# EAGLE design drone (EAGLE 9.5.2)
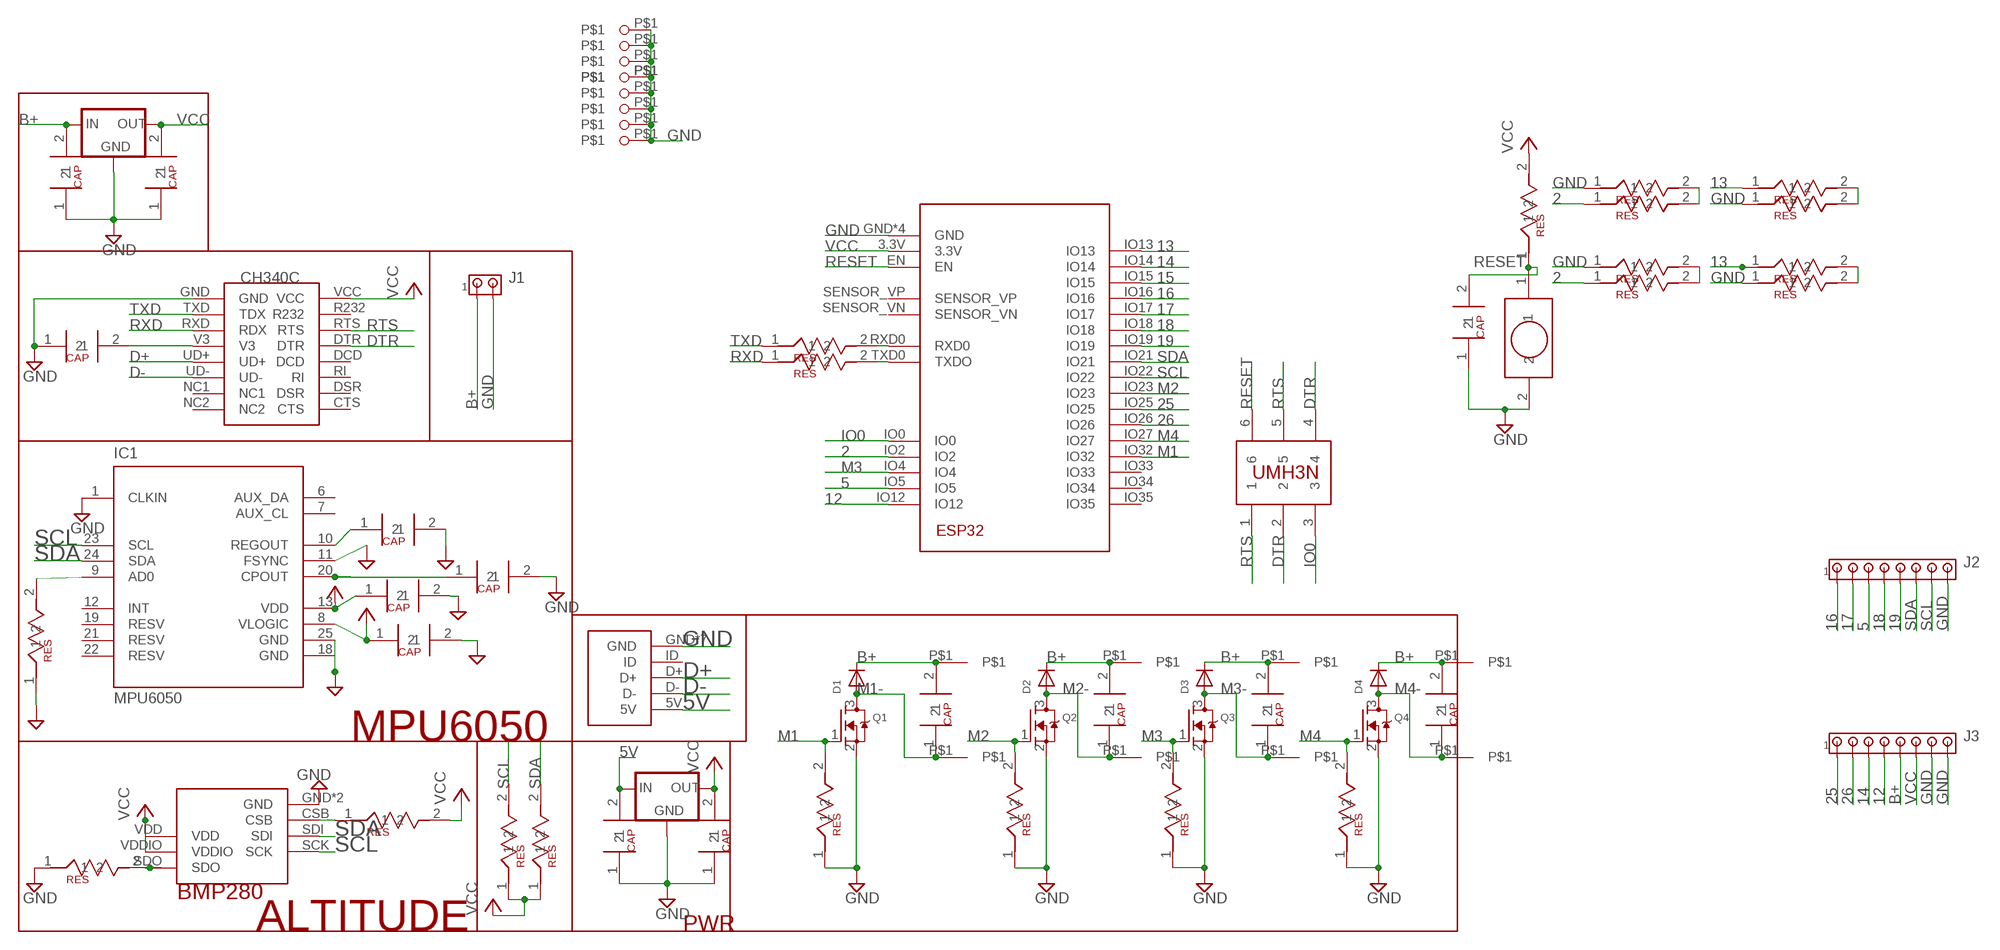
[diagram p0: schematic, sheet 1]

## Parts
D1  DIODESOD-323F  [SOD-323F]
D2  DIODESOD-323F  [SOD-323F]
D3  DIODESOD-323F  [SOD-323F]
D4  DIODESOD-323F  [SOD-323F]
IC1  MPU6050  [QFN50P400X400X95-25T265X275N]
IC2  SELF_VREG3.3MP  [SOT223]
IC3  SELF_VREG3.3MP  [SOT223]
J1  MTA02-100  [10X02MTA]
J2  MTA08-100  [10X08MTA]
J3  MTA08-100  [10X08MTA]
Q1  MOSFET-NREFLOW  [SOT23]
Q2  MOSFET-NREFLOW  [SOT23]
Q3  MOSFET-NREFLOW  [SOT23]
Q4  MOSFET-NREFLOW  [SOT23]
U1  ESP32  [MODULE_ESP-WROOM-32]
U$1  MICROUSB  [USB]
U$2  CH340C  [SOIC16]
U$3  BMP280  [BMP280]
U$4  SELF_RESISTOR_0603  [SELF_RESISTOR_0603]
U$5  SELF_RESISTOR_0603  [SELF_RESISTOR_0603]
U$6  SELF_CAP_0603  [SELF_CAP_0603]
U$7  SELF_RESISTOR_0603  [SELF_RESISTOR_0603]
U$8  SELF_CAP_0603  [SELF_CAP_0603]
U$9  SELF_CAP_0603  [SELF_CAP_0603]
U$10  SELF_CAP_0603  [SELF_CAP_0603]
U$11  SELF_RESISTOR_0603  [SELF_RESISTOR_0603]
U$12  SELF_RESISTOR_0603  [SELF_RESISTOR_0603]
U$13  SELF_CAP_0603SELF_CAP_0805  [SELF_CAP_0805]
U$14  SELF_CAP_0603SELF_CAP_0805  [SELF_CAP_0805]
U$15  SELF_CAP_0603  [SELF_CAP_0603]
U$16  SELF_RESISTOR_0603  [SELF_RESISTOR_0603]
U$17  SELF_RESISTOR_0603  [SELF_RESISTOR_0603]
U$18  SELF_CAP_0603SELF_CAP_0805  [SELF_CAP_0805]
U$19  SELF_CAP_0603SELF_CAP_0805  [SELF_CAP_0805]
U$20  SELF_RESISTOR_0603  [SELF_RESISTOR_0603]
U$21  SELF_RESISTOR_0603  [SELF_RESISTOR_0603]
U$22  SELF_RESISTOR_0603  [SELF_RESISTOR_0603]
U$23  SELF_RESISTOR_0603  [SELF_RESISTOR_0603]
U$24  SELF_CAP_0603  [SELF_CAP_0603]
U$25  SELF_CAP_0603  [SELF_CAP_0603]
U$26  SELF_CAP_0603  [SELF_CAP_0603]
U$27  SELF_CAP_0603  [SELF_CAP_0603]
U$28  UMH3N  [UMH3N]
U$29  SELF_PUSHBUTTON  [SELF_PUSHBUTTON]
U$30  SELF_RESISTOR_0603  [SELF_RESISTOR_0603]
U$31  SELF_CAP_0603  [SELF_CAP_0603]
U$32  SELF_RESISTOR_0603  [SELF_RESISTOR_0603]
U$33  SELF_RESISTOR_0603  [SELF_RESISTOR_0603]
U$34  SELF_RESISTOR_0603  [SELF_RESISTOR_0603]
U$35  SELF_RESISTOR_0603  [SELF_RESISTOR_0603]
U$36  SELF_RESISTOR_0603  [SELF_RESISTOR_0603]
U$37  SELF_RESISTOR_0603  [SELF_RESISTOR_0603]
U$38  SELF_RESISTOR_0603  [SELF_RESISTOR_0603]
U$39  SELF_RESISTOR_0603  [SELF_RESISTOR_0603]
U$40  SELF_PINOUTS  [PINOUTS]
U$41  SELF_PINOUTS  [PINOUTS]
U$42  SELF_PINOUTS  [PINOUTS]
U$43  SELF_PINOUTS  [PINOUTS]
U$44  SELF_PINOUTS  [PINOUTS]
U$45  SELF_PINOUTS  [PINOUTS]
U$46  SELF_PINOUTS  [PINOUTS]
U$47  SELF_PINOUTS  [PINOUTS]
U$48  SELF_PIN2  [PIN2]
U$49  SELF_PIN2  [PIN2]
U$50  SELF_PIN2  [PIN2]
U$51  SELF_PIN2  [PIN2]
U$52  SELF_PIN2  [PIN2]
U$53  SELF_PIN2  [PIN2]
U$54  SELF_PIN2  [PIN2]
U$55  SELF_PIN2  [PIN2]
U$56  SELF_PIN2  [PIN2]

## Nets
2: U1.IO2 U$33.1 U$39.1
5: J2.3 U1.IO5
5V: IC2.VIN(IN) U$1.5V U$13.2
12: J3.4 U1.IO12
13: U1.IO13 U$34.1 U$36.1
14: J3.3 U1.IO14
15: U1.IO15
16: J2.1 U1.IO16
17: J2.2 U1.IO17
18: J2.4 U1.IO18
19: J2.5 U1.IO19
25: J3.1 U1.IO25
26: J3.2 U1.IO26
B+: D1.C D2.C D3.C D4.C IC3.VIN(IN) J1.1 J3.5 U$19.2 U$24.2 U$25.2 U$26.2 U$27.2 U$40.P$1 U$42.P$1 U$44.P$1 U$46.P$1
D+: U$1.D+ U$2.UD+
D-: U$1.D- U$2.UD-
DTR: U$2.DTR U$28.2 U$28.4
GND: IC1.1(CLKIN) IC1.11(FSYNC) IC1.18(GND) IC1.25(GND) IC2.GND IC3.GND J1.2 J2.8 J3.7 J3.8 Q1.2(S) Q2.2(S) Q3.2(S) Q4.2(S) U1.GND U1.GND1(GND) U1.GND2(GND) U1.GND3(GND) U$1.GND U$1.GND1(GND) U$1.GND2(GND) U$1.GND3(GND) U$1.GND4(GND) U$1.GND5(GND) U$1.GND6(GND) U$2.GND U$3.GND U$3.GND1(GND) U$5.1 U$6.2 U$7.1 U$8.2 U$9.2 U$10.2 U$13.1 U$14.1 U$15.1 U$18.1 U$19.1 U$20.1 U$21.1 U$22.1 U$23.1 U$29.2 U$31.1 U$32.1 U$35.1 U$37.1 U$38.1 U$48.P$1 U$49.P$1 U$50.P$1 U$51.P$1 U$52.P$1 U$53.P$1 U$54.P$1 U$55.P$1 U$56.P$1
IO0: U1.IO0 U$28.3
M1: Q1.1(G) U1.IO32 U$20.2
M1-: D1.A Q1.3(D) U$24.1 U$41.P$1
M2: Q2.1(G) U1.IO23 U$21.2
M2-: D2.A Q2.3(D) U$26.1 U$43.P$1
M3: Q3.1(G) U1.IO4 U$22.2
M3-: D3.A Q3.3(D) U$27.1 U$45.P$1
M4: Q4.1(G) U1.IO27 U$23.2
M4-: D4.A Q4.3(D) U$25.1 U$47.P$1
N$1: U$32.2 U$33.2
N$2: U$38.2 U$39.2
N$4: U$34.2 U$35.2
N$5: U$36.2 U$37.2
N$13: U$3.SDO U$5.2
N$14: U$3.CSB U$4.1
N$15: IC1.9(AD0) U$7.2
N$16: IC1.10(REGOUT) U$8.1
N$17: IC1.20(CPOUT) U$10.1
N$18: U1.RXD0 U$16.2
N$19: U1.TXD0(TXDO) U$17.2
N$26: U$2.V3 U$15.2
RESET: U1.EN U$28.6 U$29.1 U$30.1 U$31.2
RTS: U$2.RTS U$28.1 U$28.5
RXD: U$2.RXD(RDX) U$17.1
SCL: IC1.23(SCL) J2.7 U1.IO22 U$3.SCK U$11.2
SDA: IC1.24(SDA) J2.6 U1.IO21 U$3.SDI U$12.2
TXD: U$2.TXD(TDX) U$16.1
VCC: IC1.8(VLOGIC) IC1.13(VDD) IC2.VOUT1(OUT) IC2.VOUT(OUT) IC3.VOUT1(OUT) IC3.VOUT(OUT) J3.6 U1.3.3V U$2.VCC U$3.VDD U$3.VDDIO U$4.2 U$6.1 U$9.1 U$11.1 U$12.1 U$14.2 U$18.2 U$30.2
Unconnected: IC1.2(NC) IC1.3(NC) IC1.4(NC) IC1.5(NC) IC1.6(AUX_DA) IC1.7(AUX_CL) IC1.12(INT) IC1.14(NC) IC1.15(NC) IC1.16(NC) IC1.17(NC) IC1.19(RESV) IC1.21(RESV) IC1.22(RESV) U1.IO33 U1.IO34 U1.IO35 U1.SENSOR_VN U1.SENSOR_VP U$1.ID U$2.CTS U$2.DCD U$2.DSR U$2.NC1 U$2.NC2 U$2.R232 U$2.RI

## Notes on the sheet
- MPU6050
- ALTITUDE | PWR

## Library data of the parts
D1-D4 = adafruit:DIODE: Diode SMADIODE - SMA Surface Mount Package 20V 1A Schottky Diode Digikey: 641-1014-6-ND DO-1N4148 - Through Hole Small Current Diode SOD-123 20V 1 A (.5mV Vf) Schottky Diode - Digikey: MBRX120TPMSCT-ND SOD-323 10V 570mA (.38mV Vf, 3ns) Schottky Diode - Digikey: ZLLS410CT-ND SOD-523 30V 30mA Schottky Diode (RB751S-40TE61) - Digikey: RB751S-40TE61CT-ND SOT23-R/W - SOT23 Package (R = Solder Paste/Reflow Ovens, W = Hand-Soldering) BAT54Film 40V 300mA - Digikey: 497-7162-1-ND
IC1 = invensense:MPU6050: The triple-axis MEMS gyroscope
IC2 IC3 = V_REG:SELF_VREG: 800mA Low-Dropout Linear Regulator Source: http://www.ti.com/lit/ds/symlink/lm1117-n.pdf; MF: Texas Instruments; MPN: LM1117MP-3.3; OC_FARNELL: 9778195; OC_NEWARK: 28X3416
J1 = con-amp:MTA02-100: AMP connector
J2 J3 = con-amp:MTA08-100: AMP connector
Q1-Q4 = adafruit:MOSFET-N: N-Channel Mosfet 2N7002E - 60V 260mA SOT23 [Digikey: 2N7002ET1GOSTR-ND] - REEL BSH103 - 30V 850mA SOT23 [Digikey: 568-5013-1-ND]
U1 = ESP-WROOM-32:ESP32: Module: combo; GPIO, I2C x2, I2S x2, SDIO, SPI x3, UART x3; 19.5dBm
U$1 = micro usb:MICROUSB
U$2 = ch340g:CH340C
U$3 = BMP280:BMP280
U$4 U$5 U$7 U$11 U$12 U$16 U$17 U$20-U$23 U$30 U$32-U$39 = SELF_RESISTORS:SELF_RESISTOR_0603
U$6 U$8-U$10 U$13-U$15 U$18 U$19 U$24-U$27 U$31 = SELF_CAP:SELF_CAP_0603
U$28 = UMH3N:UMH3N
U$29 = self_pushbutton:SELF_PUSHBUTTON
U$40-U$47 = PIN:SELF_PINOUTS
U$48-U$56 = PIN2:SELF_PIN2

## Board
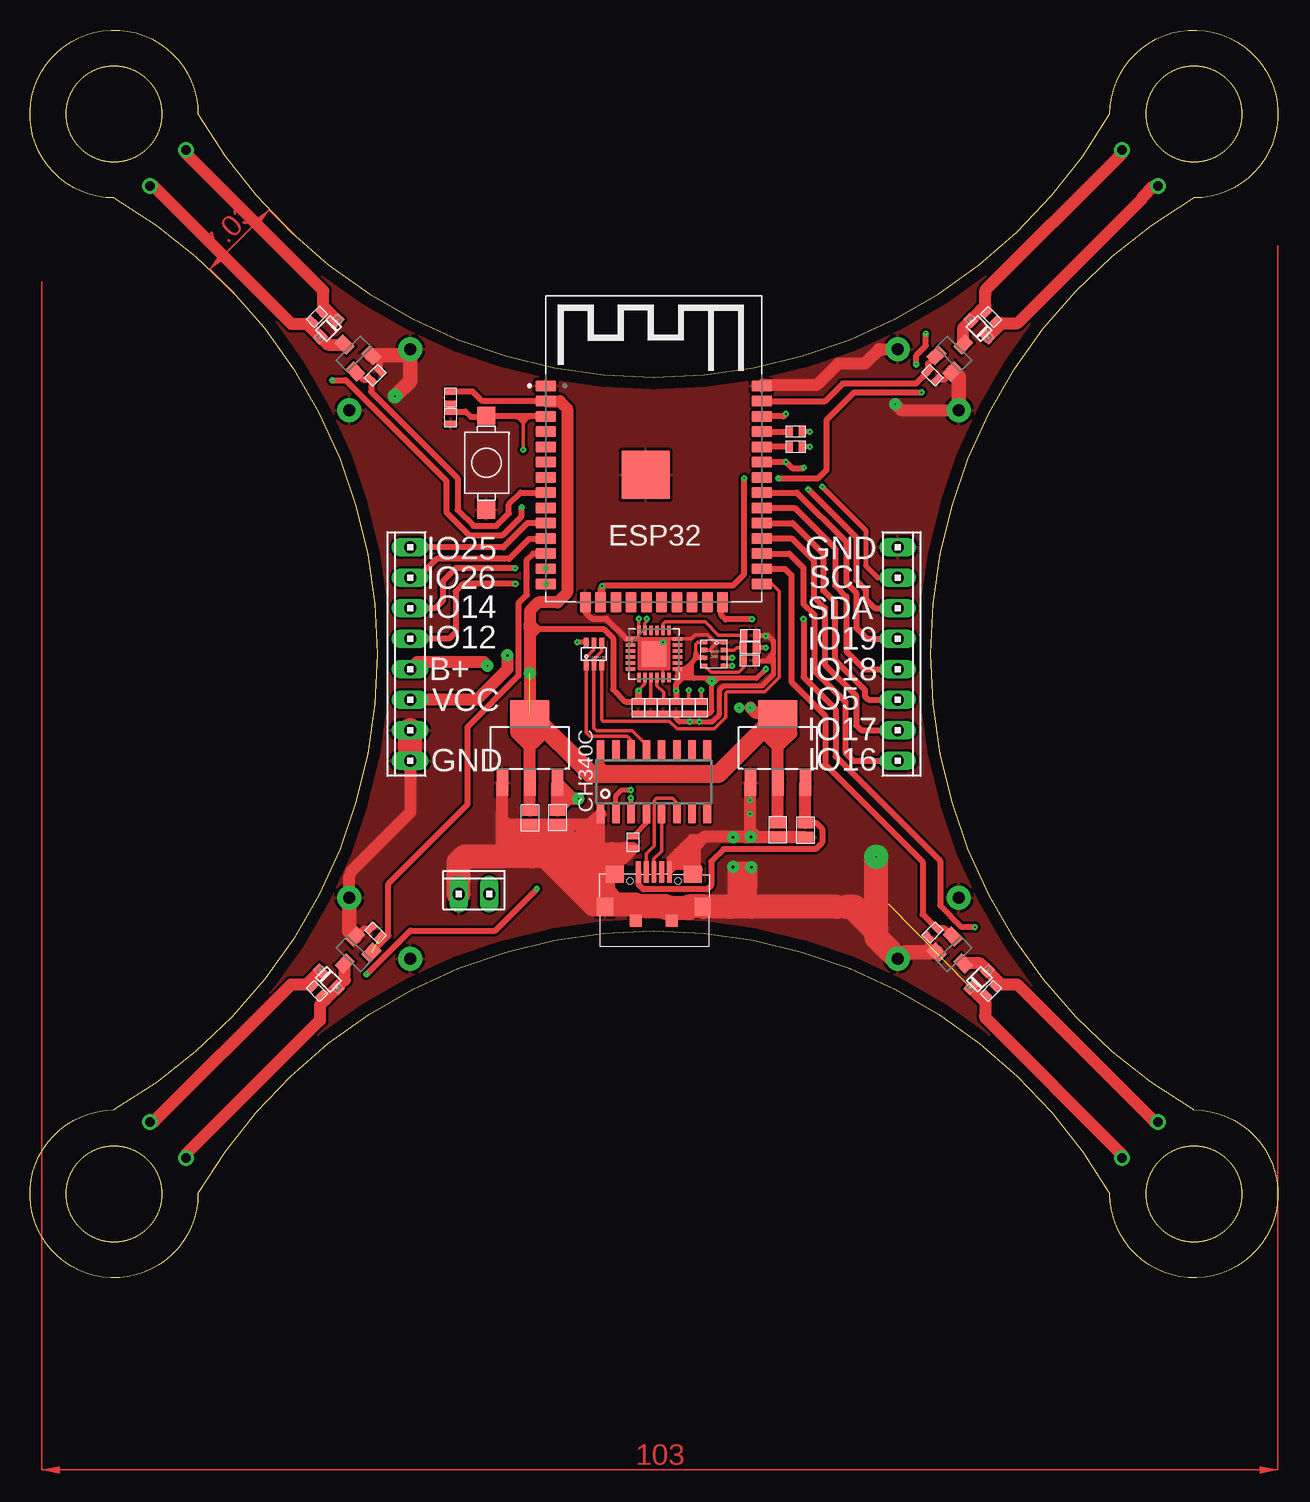
[diagram p1: board, top side]
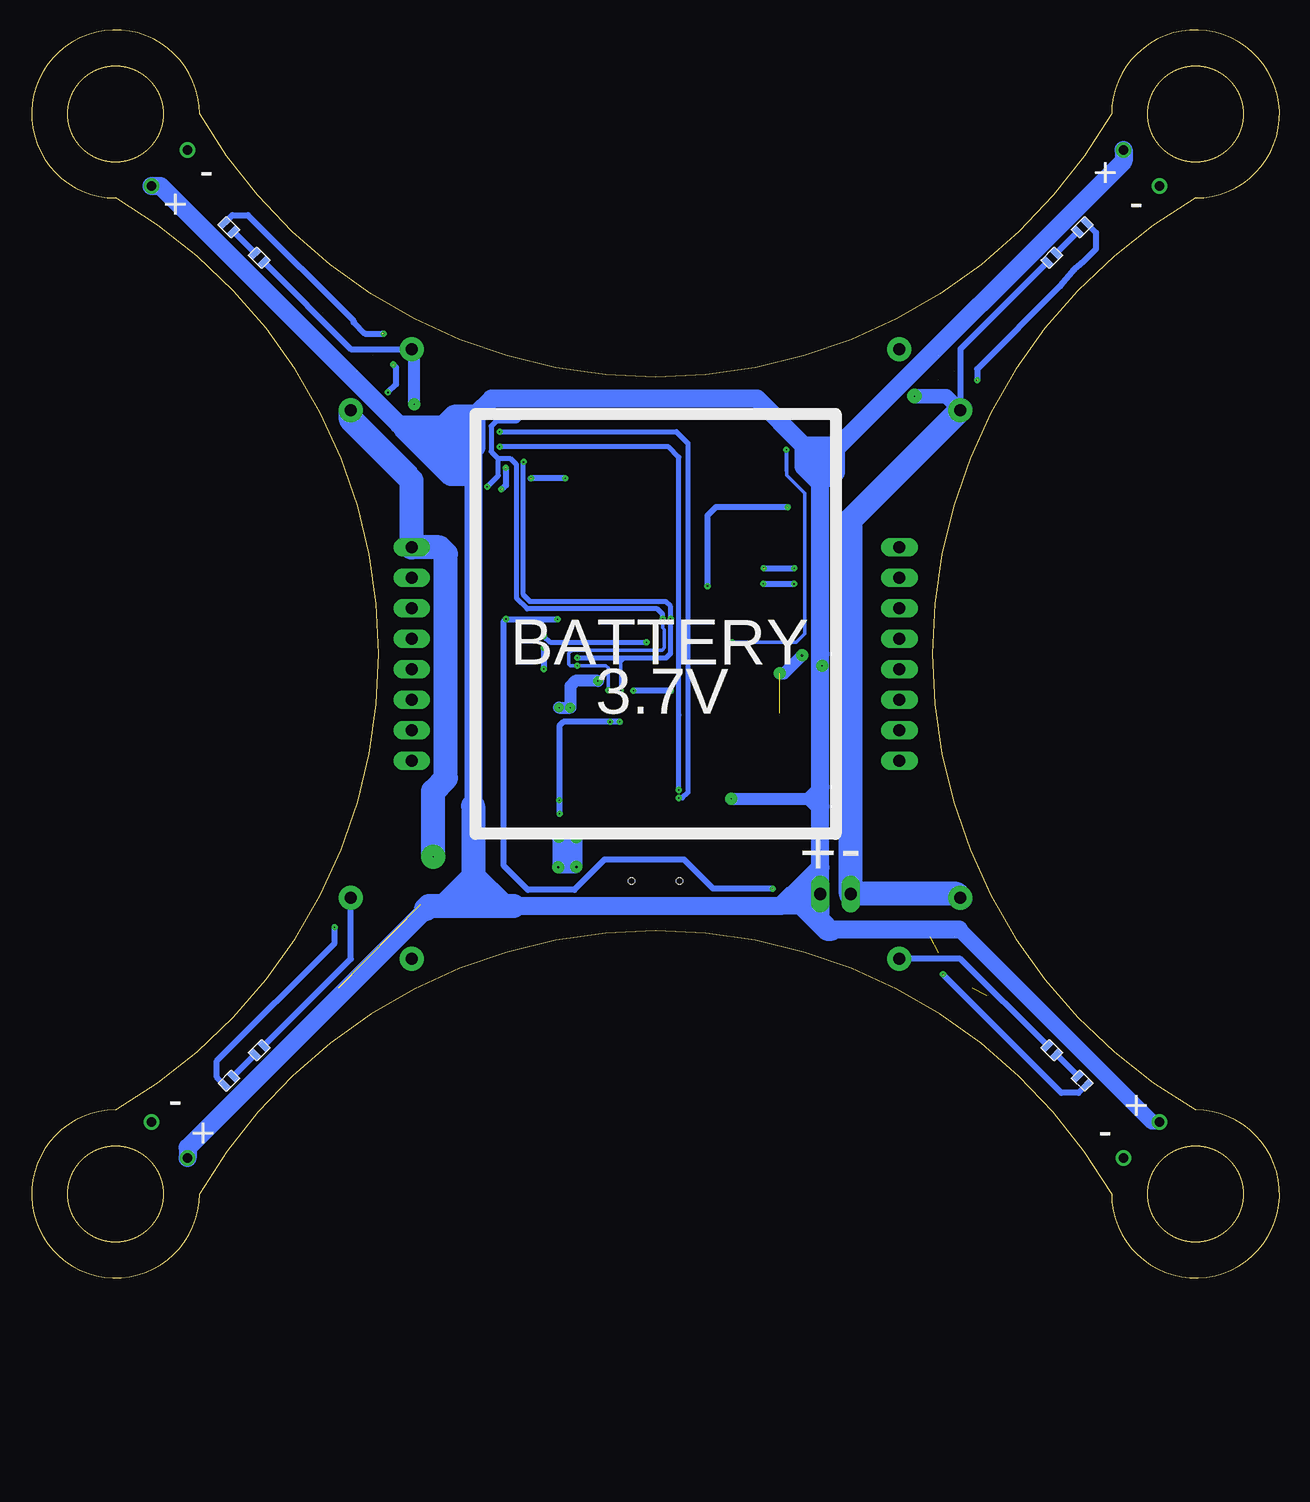
[diagram p2: board, bottom side, seen from below]

Size 103.99 x 103.99 mm. Coordinates in mm from the lower left corner, seen from the top.
Outline: 14,97 arc120 90,97 arc-270 97,90 arc120 97,14 arc-270 90,7 arc120 14,7 arc-270 7,14 arc120 7,90 arc-270 14,97
Outline: circle at 7,97 radius 4
Outline: circle at 7,7 radius 4
Outline: circle at 97,7 radius 4
Outline: circle at 97,97 radius 4
Copper layers (1*16): Top 0.035mm / dielectric 1.5mm / Bottom 0.035mm
Design rules "default *": minimum track width 6mil, minimum drill 0.35mm, track to track 6mil, track to pad 6mil, pad to pad 6mil, via to via 6mil, smd to smd 6mil, copper to edge 40mil, drill to drill 6mil, minimum pad ring 10mil, minimum via ring 8mil, stop-mask expansion 4mil, vias tented up to drill 10mm, thermal gap 10mil

### Footprints (pad centres in the part's own frame; a part is rotated, then mirrored left to right if it is on the bottom)
SOD-323F = smd 1 x 0.8: A -1,0; C 1,0
QFN50P400X400X95-25T265X275N = smd 0.26 x 0.79: 1 -1.25,-1.97; 2 -0.75,-1.97; 3 -0.25,-1.97; 4 0.25,-1.97; 5 0.75,-1.97; 6 1.25,-1.97; 13 1.25,1.97; 14 0.75,1.97; 15 0.25,1.97; 16 -0.25,1.97; 17 -0.75,1.97; 18 -1.25,1.97 | smd 0.79 x 0.26: 7 1.97,-1.25; 8 1.97,-0.75; 9 1.97,-0.25; 10 1.97,0.25; 11 1.97,0.75; 12 1.97,1.25; 19 -1.97,1.25; 20 -1.97,0.75; 21 -1.97,0.25; 22 -1.97,-0.25; 23 -1.97,-0.75; 24 -1.97,-1.25 | smd 2.15 x 2.05: 25 0,0
SOT223 = smd 0.95 x 2.15: GND -2.3,-2.9; VIN 2.3,-2.9; VOUT 0,-2.9 | smd 3.25 x 2.15: VOUT1 0,2.9
10X02MTA = drill 1.016 long: 1 1.27,0; 2 -1.27,0
10X08MTA = drill 1.016 long: 1 8.89,0; 2 6.35,0; 3 3.81,0; 4 1.27,0; 5 -1.27,0; 6 -3.81,0; 7 -6.35,0; 8 -8.89,0
SOT23 = smd 1 x 1.4: 1 -0.95,-1.1; 2 0.95,-1.1; 3 0,1.1
MODULE_ESP-WROOM-32 = smd 1.7 x 0.9: 3.3V -9,6.985; EN -9,5.715; GND -9,8.255; GND3 9,8.255; IO0 9,-8.255; IO4 9,-6.985; IO5 9,-3.175; IO12 -9,-8.255; IO14 -9,-6.985; IO16 9,-5.715; IO17 9,-4.445; IO18 9,-1.905; IO19 9,-0.635; IO21 9,1.905; IO22 9,5.715; IO23 9,6.985; IO25 -9,-3.175; IO26 -9,-4.445; IO27 -9,-5.715; IO32 -9,-0.635; IO33 -9,-1.905; IO34 -9,1.905; IO35 -9,0.635; NC 9,0.635; RXD0 9,3.175; SENSOR_VN -9,3.175; SENSOR_VP -9,4.445; TXD0 9,4.445 | smd 0.9 x 1.7: CLK 0.635,-9.755; CMD -0.635,-9.755; GND2 -5.715,-9.755; IO2 5.715,-9.755; IO13 -4.445,-9.755; IO15 4.445,-9.755; SD0 1.905,-9.755; SD1 3.175,-9.755; SD2 -3.175,-9.755; SD3 -1.905,-9.755 | smd 4 x 4: GND1 -0.7,0.845
USB = smd 0.4 x 1.8: 5V -1.298,0.204; D+ 0.002,0.204; D- -0.648,0.204; GND 1.302,0.204; ID 0.652,0.204 | smd 1.5 x 1.4: GND1 3.25,0; GND6 -3.25,0 | smd 1.35 x 1.5: GND2 4.075,-2.7; GND5 -4.075,-2.7 | smd 1 x 1: GND3 1.5,-3.85; GND4 -1.5,-3.85 | hole 0.5: -2,-0.55; 2,-0.55
SOIC16 = smd 0.635 x 1.524: CTS 4.445,2.695; DCD 0.635,2.695; DSR 3.175,2.695; DTR -0.635,2.695; GND -4.445,-2.695; NC1 3.175,-2.695; NC2 4.445,-2.695; R232 -3.175,2.695; RI 1.905,2.695; RTS -1.905,2.695; RXD -1.905,-2.695; TXD -3.175,-2.695; UD+ 0.635,-2.695; UD- 1.905,-2.695; V3 -0.635,-2.695; VCC -4.445,2.695
BMP280 = smd 0.5 x 0.35: CSB 0.8,0.325; GND 0.8,0.975; GND1 -0.8,0.325; SCK 0.8,-0.975; SDI 0.8,-0.325; SDO -0.8,-0.975; VDD -0.8,0.973; VDDIO -0.8,-0.325
SELF_RESISTOR_0603 = smd 0.5 x 0.9: 1 0.5,0; 2 -0.5,0
SELF_CAP_0603 = smd 0.5 x 0.9: 1 0.5,0; 2 -0.5,0
SELF_CAP_0805 = smd 0.9 x 1.3: 1 0.6,0; 2 -0.6,0
UMH3N = smd 0.4 x 0.8: 1 -0.65,-0.97; 2 0,-0.97; 3 0.65,-0.97; 4 0.65,0.97; 5 0,0.97; 6 -0.65,0.97
SELF_PUSHBUTTON = smd 1.5 x 1.5: 1 0,3.9; 2 0,-3.9
PINOUTS = drill 0.8 pad 1.3: P$1 0,0
PIN2 = drill 1 pad 2: P$1 0,0

### Placement (x,y rotation side)
D1  24.89,79.11 45 top
D2  79.1,79.11 315 top
D3  79.11,24.89 225 top
D4  24.89,24.88 135 top
IC1  52,52 270 top
IC2  62.33,44.17 0 top
IC3  41.66,44.17 0 top
J1  37,32 0 top
J2  72.32,52 270 top
J3  31.68,52 90 top
Q1  26.99,77 45 top
Q2  76.99,77 315 top
Q3  77,27 224.4 top
Q4  27,26.99 135.4 top
U1  52,66.08 0 top
U$1  52,33.63 0 top
U$2  52,41.35 0 top
U$3  57,52 0 top
U$4  60,52.51 180 top
U$5  60,51.45 0 top
U$6  50.69,47.53 90 top
U$7  51.74,47.52 270 top
U$8  52.79,47.53 90 top
U$9  53.84,47.53 90 top
U$10  60,53.56 180 top
U$11  55.95,47.52 270 top
U$12  54.9,47.52 270 top
U$13  64.61,37.31 270 top
U$14  62.31,37.33 270 top
U$15  50.26,36.32 270 top
U$16  63.82,69.25 0 top
U$17  63.82,70.52 0 top
U$18  41.66,38.35 270 top
U$19  43.95,38.37 270 top
U$20  28.78,75.22 45 top
U$21  75.21,75.22 315 top
U$22  75.21,28.78 225 top
U$23  28.78,28.77 135 top
U$24  23.91,80.08 225 top
U$25  23.91,23.91 315 top
U$26  80.08,80.08 135 top
U$27  80.08,23.91 45 top
U$28  47,52 0 top
U$29  38.03,67.93 0 top
U$30  35.05,73.36 270 top
U$31  35.05,71.69 270 top
U$32  18.98,18.98 135 bottom
U$33  16.44,16.44 315 bottom
U$34  16.44,87.56 45 bottom
U$35  18.98,85.02 225 bottom
U$36  87.56,87.56 135 bottom
U$37  85.02,85.02 315 bottom
U$38  85.02,18.98 45 bottom
U$39  87.56,16.44 225 bottom
U$40  10,13 0 top
U$41  10,91 0 top
U$42  91,10 0 top
U$43  91,94 0 top
U$44  13,94 0 top
U$45  94,13 0 top
U$46  94,91 0 top
U$47  13,10 0 top
U$48  31.68,26.6 0 top
U$49  26.6,31.68 0 top
U$50  72.32,26.6 0 top
U$51  77.4,31.68 0 top
U$52  77.4,72.32 0 top
U$53  72.32,77.4 0 top
U$54  31.68,77.4 0 top
U$55  26.6,72.32 0 top
U$56  31.68,26.6 0 top

### Tracks (layer width: path | path; a pad name or v marks a point on that pad's centre or on a via)
2  (via drill 0.1 pad 0.5)  (2 unrouted)
  Top 0.508: v60.17,54.89 57.96,54.89 57.62,55.23 57.62,56.23 U1.IO2 | v64.46,54.91 64.46,50.06 67.14,47.38 67.14,43.46 75.84,34.77 75.84,31.01 77.62,29.23 v78.75,29.23 | v28.04,25.3 31.69,28.95 38.78,28.95 42.22,32.39
  Bottom 0.508: U$39.1 88.56,16.74 88.56,18.09 78.75,27.9 78.75,29.14 | 78.75,29.14 78.75,29.15 | 78.75,29.14 v78.75,29.23 | v60.17,54.89 64.44,54.89 v64.46,54.91 64.63,54.73 64.63,34.33 62.64,32.34 58.77,32.34 56.26,34.85 49.62,34.85 47.22,32.45 42.26,32.45 v42.23,32.42 | U$33.1 16.75,15.41 18.17,15.41 28.03,25.28
5
  Top 0.508: U1.IO5 63.54,62.9 66.1,60.34 66.1,57.3 67.06,56.34 67.06,51.52 69.57,49.01 69.57,48.48 69.86,48.19 J2.3
5V
  Top 0.5: U$13.2 65.54,37.91 66.02,37.43 66.02,36.28 65.47,35.74 57.79,35.74 56.76,34.7 56.76,32.69 56.46,32.38 51.13,32.38 50.7,32.81 U$1.5V
  Top 1: U$13.2 64.61,41.25 IC2.VIN
12  (via drill 0.1 pad 0.5)
  Top 0.508: U1.IO12 43,57.86 v43.01,57.86 | v40.46,57.83 36.12,57.83 35.47,57.18 35.47,53.81 34.92,53.27 J3.4
  Bottom 0.508: v43.01,57.86 40.48,57.86 v40.46,57.83
13  (via drill 0.1 pad 0.5)  (5 unrouted)
  Top 0.508: v59.52,66.63 59.52,58.63 58.59,57.7 47.83,57.7 47.55,57.43 U1.IO13 47.67,56.44 v47.67,57.65 | v62.37,66.65 65.71,66.65 66.39,67.33 66.39,71.51 68.68,73.8 74.28,73.8 v74.3,73.79 | v73.86,76.12 73.86,76.89 74.66,77.69 v74.66,78.69 | v25.2,74.82 26.3,74.82 34.7,66.42 34.7,63.82 36.62,61.89 39.38,61.89 40.98,63.49 40.98,64.17
  Bottom 0.508: U$36.1 87.26,88.56 85.96,88.56 77.16,79.76 77.16,79.63 76.23,78.69 74.76,78.69 | U$34.1 15.3,87.13 15.3,85.73 16.36,84.67 17.1,84.04 18.25,82.67 25.2,75.73 25.2,74.86 | v59.52,66.63 62.41,66.63 | v74.3,73.79 73.62,74.47 73.62,75.86 73.82,76.06 | v40.98,64.23 46.96,64.23 47.67,63.52 v47.67,57.65
14  (via drill 0.1 pad 0.5)  (1 unrouted)
  Top 0.508: v40.44,59.15 35.5,59.15 34.41,58.05 34.41,56.43 33.78,55.81 J3.3
  Bottom 0.508: v42.99,59.15 v40.44,59.15
16
  Top 0.508: U1.IO16 63.26,60.36 64.45,59.17 64.45,56.16 65.36,55.25 65.36,50.58 67.94,48 67.94,43.78 68.62,43.11 J2.1
17
  Top 0.508: U1.IO17 63.48,61.63 65.3,59.81 65.3,56.74 66.24,55.81 66.24,51.12 68.85,48.5 68.85,46.05 69.25,45.65 J2.2
18
  Top 0.508: U1.IO18 63.71,64.17 67.09,60.8 67.09,57.7 68.02,56.77 68.02,52.24 69.53,50.73 J2.4
19
  Top 0.508: U1.IO19 63.91,65.44 68.02,61.33 68.02,57.94 68.85,57.12 68.85,54.18 69.77,53.27 J2.5
25
  Top 0.508: U1.IO25 41.46,62.9 39.44,60.89 J3.1
26
  Top 0.508: U1.IO26 42.93,61.57 41.58,61.57 39.93,59.92 33.9,59.92 32.37,58.39 32.37,58.32 31.7,58.32 J3.2
B+  (via drill 0.1 pad 1)  (1 unrouted)
  Top 0.203: U$27.2 79.73,23.1 79.61,22.97 | U$25.2 23.19,24.26 23.02,24.43 | D1.C 24.89,79.81 U$24.2 | U$26.2 80.81,79.73 80.98,79.57
  Top 1: IC3.VIN 43.95,41.25 43.95,39.92 U$19.2 | D4.C 23.02,24.43 21.84,24.43 | D1.C 24.45,80.96 24.45,82.26 | D2.C 80.98,79.57 82.29,79.57 | D3.C 79.61,22.97 79.61,22 79.61,21.67
  Top 1.016: v45.7,39.92 43.95,39.92 | v45.7,39.92 45.28,39.92 43.95,41.25 | v45.7,39.92 44.9,39.92 U$19.2 | v38.12,51.02 37.83,51.31 32.26,51.31 J3.5 | 21.84,24.43 21.76,24.43 10.32,13 U$40.P$1 | 79.61,22 79.61,21.67 91,10.28 U$42.P$1 | 24.45,82.26 13,93.72 U$44.P$1 | 82.29,79.57 92.67,89.94 92.67,90 93.66,91 U$46.P$1
  Bottom 0.5: 71.13,31.56 71.55,31.13
  Bottom 1.016: v45.7,39.92 39.3,39.92 | 39.3,39.92 38.89,39.92 38.27,39.3 38.67,39.3 39.3,39.92 | 39.3,39.92 38.29,40.92 38.27,40.92 | v38.12,51.02 38.12,51.85 38.27,52
  Bottom 1.27: 26.7,29.04 26.68,29.04 10.63,13 U$40.P$1
  Bottom 1.5: J1.1 38.27,29.38 | 38.27,29.38 37.77,28.88 | 37.77,28.88 37.76,28.87 37.26,28.87 37.44,29.04 | 37.44,29.04 26.7,29.04 | J1.1 40.34,32 | 63.85,31 41.55,31 | J1.1 38.27,34.22 | 38.27,34.22 38.27,39.3 38.27,40.92 38.27,52 38.27,66.23 | 38.27,66.23 38.27,67.24 | 38.27,67.24 38.27,68.08 | 38.27,68.08 36.96,69.39 | 67.19,66.73 67.19,39.31 | 71.69,69.32 73.14,70.77 73.04,70.77 | 38.27,68.08 38.36,68.08 39.67,69.4 | 39.67,69.4 43.54,73.27 65.66,73.27 66.93,72.01 | 68.2,70.74 66.93,72.01 | 68.2,70.74 69.62,69.32 | 69.62,69.32 71.69,69.32 | 68.2,70.74 68.2,69.28 | 68.2,69.28 68.2,67.95 67.19,68.96 | 67.19,68.96 67.19,66.73 | 39.67,69.4 36.98,69.4 36.96,69.39 | 36.96,69.39 36.96,69.1 | 36.96,69.1 36.96,67.11 37.4,66.67 37.7,66.67 38.27,67.24 | 39.67,69.4 39.67,67.64 38.27,66.23 | 38.27,34.22 40.34,32.14 40.34,32 | 40.34,32 39.34,31 | 37.77,28.88 37.77,29.43 39.34,31 | 38.27,29.38 39.34,30.45 | 39.34,30.45 39.34,31 | 39.34,31 39.89,31 | 39.34,30.45 39.89,31 | 39.89,31 41.55,31 | 40.34,32 40.55,32 41.55,31 | 37.44,29.04 38.27,29.87 J1.1 | 71.13,30.74 91,10.87 U$42.P$1 | 66.93,72.01 66.93,70.55 | 66.93,70.55 68.2,69.28 | 66.93,70.55 66.93,69.22 67.19,68.96 | 67.19,66.73 69.62,69.16 69.62,69.32 | 67.19,66.73 69.1,66.73 71.69,69.32 | 66.93,72.01 68.83,72.01 69.71,71.13 | 69.71,71.13 70.81,70.02 71.19,70.02 72.14,70.98 | 72.14,70.98 | 72.14,70.98 72.35,70.77 73.04,70.77 | 73.04,70.77 73.41,71.13 | 73.41,71.13 69.71,71.13 | U$44.P$1 13,93.07 36.96,69.1 | 73.41,71.13 93.27,91 U$46.P$1
  Bottom 2: 71.13,30.74 70.86,31 69.21,31 | 69.21,31 67.26,31 | 67.26,31 64.7,31 | 64.7,31 63.85,31 | 67.19,39.31 67.19,33.44 | 67.19,33.44 67.19,31.07 67.26,31 | 64.7,31 67.14,33.44 67.19,33.44 | 67.19,33.44 69.21,31.42 69.21,31
D+
  Top 0.305: U$1.D+ 52,34.92 52.63,35.55 U$2.UD+
D-
  Top 0.254: 51.36,33.85 U$1.D-
  Top 0.305: U$1.D- 51.35,35.36 52.01,36.02 52.01,39.77 52.2,39.96 53.56,39.96 53.9,39.62 U$2.UD-
DTR
  Top 0.305: U$28.4 47.65,52.22 47,51.57 U$28.2 47,45.81 47.22,45.59 50.18,45.59 51.36,44.41 U$2.DTR
GND  (via drill 0.1 pad 0.4, 0.1 pad 1, 0.1 pad 1.2, 0.1 pad 2, 0.2 pad 1)  (3 unrouted)
  Top 0.3: 57.28,52.97 57.07,52.97 | IC1.18 55.09,53.25 55.44,53.59 56.45,53.59 57.07,52.97 | 56.69,52.38 56.96,52.65 57.07,52.76 57.07,52.97 | v61.3,53.49 61.23,53.56 | 60.83,53.57 U$10.2
  Top 0.305: U$3.GND1 56.63,52.32 56.69,52.38 | 56.96,52.65 57.28,52.97 U$3.GND | IC1.11 52.75,50.75 53,51 IC1.25 51,52 51,53 | IC1.18 IC1.1
  Top 0.4: U$10.2 61.23,53.57 | 61.23,53.57 v61.3,53.49 61.58,53.49 | U$5.1 61.39,51.45 | 61.39,51.45 61.73,51.45 | 61.58,53.49 61.94,53.13 61.94,52 | 61.58,53.49 61.5,53.57 61.23,53.57 | IC1.25 52,52.22 v52.75,52.97 | 53.84,46.92 53.84,46.6 54.12,46.33 | 53.84,46.92 U$9.2 53.84,46.92 | v55.78,46.33 56.85,46.33 57.47,46.95 57.47,48.99 57.82,49.34 61.02,49.34 61.94,50.26 61.94,51.25 | 61.73,51.45 61.94,51.25 | 61.73,51.45 61.94,51.65 | 61.94,51.65 61.94,52 | 61.39,51.45 61.94,52 | 61.94,51.65 61.94,51.25 | v54.97,46.34 54.13,46.34 54.12,46.33 | 53.84,46.92 | v55.79,46.33 v55.78,46.33 | v55.78,46.33 54.12,46.33 | v60.01,39.8 60.01,41.25 IC2.GND 60,41.24 v60,38.67
  Top 0.45: 51,53 50.75,53.25 IC1.1 49.68,53.25
  Top 0.5: U1.GND2 46.28,55.49 46.83,54.94 47.98,54.94 49.68,53.25
  Top 0.508: Q3.2 74.86,27.81 U$22.1 | Q1.2 29.14,76.2 U$20.1 | Q4.2 27.78,29.13 U$23.1 | Q2.2 76.2,74.86 U$21.1 | U$6.2 51.73,47.03 U$7.1 52.78,47.02 U$8.2 U$9.2 | U$9.2 | U$5.1 | 53.3,34.64 U$1.GND 53.74,34.28 54.6,34.28 | 53.3,34.64 53.3,34.94 53.61,35.25 | 53.61,35.25 53.81,35.45 | 53.81,35.45 53.98,35.62 | 54.35,35.99 54.4,36.04 | 54.4,36.04 55.09,36.73 56.16,36.73 | 55.42,35.99 55.37,36.04 54.54,36.04 | 54.54,36.04 54.4,36.04 | 55.42,35.99 54.35,35.99 | 54.35,35.99 53.98,35.62 | 53.98,35.62 54.01,35.62 54.54,35.1 | 55.42,34.22 55.11,34.53 | 55.11,34.53 54.73,34.9 | 54.54,36.04 54.54,35.1 | 54.54,35.1 54.73,34.9 | 55.42,35.99 54.73,35.31 54.73,34.9 | U$1.GND1 54.6,34.28 | 53.81,35.07 53.63,35.25 53.61,35.25 | 54.6,34.28 54.85,34.53 | 55.11,34.53 54.85,34.53 | 54.6,34.28 54.14,34.73 | 54.14,34.73 53.98,34.9 | 53.81,35.45 53.81,35.07 | 54.51,35.07 54.17,34.73 54.14,34.73 | 54.73,34.9 53.98,34.9 | 53.98,34.9 53.81,35.07 | 54.54,35.1 54.51,35.07 | 54.51,35.07 53.81,35.07 | 54.85,34.53 54.7,34.53 54.63,34.6 53.34,34.6 | 53.34,34.6 53.3,34.64 | 53.81,35.07 53.34,34.6
  Top 1: U$18.1 | U$13.1 62.34,36.71 U$14.1 60.57,36.73 | U$19.1 43.94,37.75 43.29,37.75 42.31,37.75 U$18.1 | U$18.1 41.2,37.75 40.46,37.75 39.76,37.75 39.33,38.18 39.33,38.77 39.33,41.24 IC3.GND | IC2.GND 60.03,37.27 60.57,36.73 | 60.58,36.72 60.57,36.73
  Top 1.016: v72.09,72.81 72.59,72.32 U$52.P$1 | U1.GND3 61.1,74.44 65.6,74.44 67.38,76.22 69.58,76.22 70.76,77.4 U$53.P$1 | J3.8 31.68,38.79 26.79,33.9 26.6,33.38 U$49.P$1 | 46.65,37.75 U$2.GND 47.44,38.54 47.44,36.02 | 43.95,37.75 43.94,37.75 | 46.65,37.75 45.84,37.75 | 45.84,37.75 43.95,37.75 | 49.46,35.82 U$15.1 49.29,34.85 49.26,34.85 | 47.65,35.82 48.49,35.82 | 48.49,35.82 49.46,35.82 | 47.65,35.82 47.44,36.02 | 47.44,36.02 46.7,36.76 | 46.7,36.76 45.84,37.63 45.84,37.75 | 46.65,37.75 45.02,36.12 | 43.87,36.27 43.87,37.67 43.95,37.75 | 45.02,36.12 45.02,36.84 44.73,37.13 43.87,36.27 | 43.87,36.27 43.87,36.11 | 44.14,34.21 44.14,35.24 45.02,36.12 | 43.29,37.75 43,37.46 43,35.13 42.31,35.82 42.31,37.75 | 41.62,36.98 41.73,37.09 41.84,36.99 41.84,35.13 41.2,35.77 41.2,37.75 | 40.46,36.29 39.3,35.13 39.3,38.74 39.33,38.77 | 40.46,36.29 40.46,37.75 | 39.76,37.75 39.76,36.99 40.46,36.29 | 44.14,34.21 44.14,33.98 45.98,35.82 | 44.14,34.21 46.7,36.76 | 45.98,35.82 46.18,36.02 47.44,36.02 | 45.98,35.82 46.99,35.82 | 46.99,35.82 47.65,35.82 | 47.44,36.02 47.44,35.41 46.58,34.55 | 46.58,34.55 45.51,33.48 45.51,34.34 46.99,35.82 | 49.46,31.31 49.26,31.31 48.22,32.34 48.22,33.81 49.04,34.63 | 47.02,31.11 46.92,31.21 46.92,34.22 | 46.92,34.22 46.58,34.55 | 46.92,34.22 | 45.41,32.71 46.92,34.22 | 46.92,34.22 | 49.46,35.82 49.46,35.05 49.26,34.85 | 49.26,34.85 49.04,34.63 | 47.33,34.63 49.04,34.63 | 47.33,34.63 46.92,34.22 | U$1.GND5 47.33,31.52 47.33,34.63 | 47.33,34.63 47.33,34.66 48.49,35.82 | 49.04,34.63 49.04,35.26 48.49,35.82 | 60.58,36.72 59.72,36.72 59.72,36.75 | 55.6,33.98 55.42,34.17 55.42,34.22 55.42,35.99 56.16,36.73 56.18,36.76 59.72,36.76 59.72,36.75
  Top 1.016: 60.09,34.24 v60.11,34.22 | 60.03,37.27 60.03,36.81 v60.08,36.75 59.72,36.75 | 58.32,30.93 58.59,31.2 v58.59,34.24 58.61,34.22 v60.11,34.22 | v60.11,34.22 60.11,30.96 60.14,30.93 | v60.11,34.22 60.11,32.68 59.2,31.77 | v60.11,34.22 59.11,33.22 59.11,32.51
  Top 1.2: v30.41,73.48 31.68,74.74 U$54.P$1 31.17,76.89 Q1.2 | Q4.2 26.6,28.94 U$49.P$1 | Q3.2 72.84,27.12 U$50.P$1 | Q2.2 77.4,75.04 U$52.P$1
  Top 1.27: U$1.GND2 U$1.GND5 | 67.24,30.93 67.98,30.93 U$50.P$1
  Top 2: J1.2 35.73,34.62 36.24,35.13 39.3,35.13 41.84,35.13 43,35.13 44.14,33.98 45.41,32.71 47.02,31.11 50.42,31.11 50.54,30.98 52.89,30.98 53.06,30.81 54.94,30.81 55.1,30.98 56.03,30.98 56.07,30.94 56.14,30.93 58.32,30.93 60.14,30.93 67.24,30.93 | U$50.P$1 70.53,28.39 70.53,29.14 | 70.53,29.14 v70.53,35.11 | 70.53,29.14 68.73,30.93 67.98,30.93 | J3.8 J3.7
  Bottom 0.4: v61.3,53.49 60.78,52.97 v52.75,52.97
  Bottom 0.5: v54.97,46.34 v55.78,46.34 v55.79,46.33 59.68,46.33 60.02,45.99 60.02,39.81 v60.01,39.8 60,39.78 v60,38.67
  Bottom 0.508: U$32.1 26.6,26.6 U$48.P$1 | U$38.1 77.4,26.6 U$51.P$1 | U$37.1 77.4,77.4 U$53.P$1 | U$35.1 26.6,77.4 U$55.P$1
  Bottom 1.016: U$52.P$1 72.32,67.24 J2.8 | J2.8 | v72.09,72.81 72.09,77.17 U$53.P$1 | v58.59,36.72 v58.59,34.25 | v58.59,34.25 v58.59,34.24 | v58.59,34.25 58.61,34.22 v60.11,34.22 60.11,36.72 v60.08,36.75 | v60.08,36.75 58.62,36.75 v58.59,36.72 | v60.08,36.75 60.08,35.73 | 60.08,35.73 59.32,34.96 59.32,35.99 v58.59,36.72 | v58.59,36.72 59.09,36.72 60.08,35.73
  Bottom 1.2: U$55.P$1 27.76,73.48 v30.41,73.48
  Bottom 2: U$55.P$1 35.73,63.19 J1.2 26.92,32 U$49.P$1 | v70.53,35.11 70.53,40.57 69.46,41.64 69.46,60.33 70.02,60.89 J2.8 72.32,66.44 77.4,71.52 U$52.P$1
  pour Top (isolate 0.2): -1.34,-1.34 -1.34,105.34 105.34,105.34 105.34,-1.34
IO0
  Top 0.3: U1.IO0 61.7,57.82 61.78,57.91 62.46,57.23 62.46,50.05 61.23,48.83 58.09,48.83 57.98,48.72 57.98,46.73 57,45.76 53.92,45.76 53.28,46.4 47.74,46.4 47.63,46.51 47.63,51.01
  Top 0.305: 47.69,50.98 U$28.3 47.63,51.01 | 61.07,57.9 U1.IO0
M1  (2 unrouted)
  Top 0.508: Q1.1 27.79,74.86 U$20.2 28.43,73.86 35.64,66.65 35.64,63.99 36.96,62.67 38.87,62.67 39.91,63.71 39.91,64.46 40.89,65.44 U1.IO32
M1-
  Top 0.203: U$24.1 23.36,79.73 23.1,79.48
  Top 1: 22,79.48 23.1,79.48 D1.A 24.8,77.78 Q1.3
  Top 1.016: 21.8,79.48 21.79,79.48 | 22,79.48 21.8,79.48 | U$41.P$1 10.28,91 21.8,79.48
M2  (1 unrouted)
  Top 0.508: U1.IO23 66.26,73.06 67.72,74.52 73.82,74.52 74.85,75.55 U$21.2 74.85,76.2 Q2.1
M2-  (1 unrouted)
  Top 0.203: U$26.1 79.52,80.65 79.23,80.65
  Top 0.508: U$26.1 79.56,80.44
  Top 1: Q2.3 77.77,79.19 D2.A 79.23,80.65 79.62,81.04 79.62,82
  Top 1.016: 79.62,82 79.62,82.33 90.73,93.44 90.75,93.44 91,93.68 U$43.P$1
M3
  Top 0.508: U1.IO4 62.91,59.09 63.44,58.56 63.44,49.66 66.25,46.85 66.25,42.81 74.39,34.67 74.39,30.3 U$22.2 76.22,29.13 Q3.1
M3-
  Top 0.203: U$27.1 80.62,24.45 80.96,24.45
  Top 0.508: 78,26.21 Q3.3
  Top 1: 82.08,24.45 80.96,24.45 D3.A 79.2,26.21 78,26.21
  Top 1.016: 82.08,24.45 82.26,24.45 93.71,13 U$45.P$1
M4  (2 unrouted)
  Top 0.508: Q4.1 29.86,28.52 29.86,32.86 36.44,39.44 36.44,45.91 40.7,50.17 40.7,56.22 41.41,56.93 41.41,59.85 41.92,60.36 U1.IO27
M4-  (2 unrouted)
  Top 0.203: U$25.1 24.56,23.55 24.76,23.35
  Top 0.508: U$25.1 24.4,23.55
  Top 1: Q4.3 26.24,26.19 26.24,24.84 24.76,23.35 24.17,22.76 24.17,22
  Top 1.016: U$47.P$1 13,10.29 24.17,21.46 24.17,22
N$1
  Bottom 0.508: U$33.2 U$32.2
N$2
  Bottom 0.508: U$39.2 U$38.2
N$4
  Bottom 0.508: U$34.2 U$35.2
N$5
  Bottom 0.508: U$36.2 U$37.2
N$13
  Top 0.305: U$3.SDO 56.75,50.47 59.06,50.47 59.5,50.9 U$5.2
N$14
  Top 0.305: U$3.CSB 58.71,52.32 58.9,52.51 U$4.1
N$15
  Top 0.305: IC1.9 51.75,48.03 U$7.2
N$16
  Top 0.305: IC1.10 52.25,49.35 52.8,48.8 U$8.1
N$17
  Top 0.305: IC1.20 52.75,54.49 52.93,54.67 56.27,54.67 57.37,53.57 U$10.1
N$18
  Top 0.508: U$16.2 60.97,69.25 U1.RXD0
N$19
  Top 0.508: U1.TXD0 60.98,70.52 U$17.2
N$26
  Top 0.4: U$2.V3 51.36,37.92 U$15.2
RESET  (via drill 0.1 pad 0.3)
  Top 0.3: v45.62,52.97 v45.61,52.97 | 41.09,71.23 41.09,71.74 41.04,71.79 | v41.09,69.01 41.09,71.23 | 41.09,71.23 41.66,71.79 | 41.09,71.23 40.52,71.79 40.49,71.79
  Top 0.4: U$28.6 v45.62,52.97
  Top 0.508: U$30.1 U$31.2 36.29,72.19 36.74,71.75 37.95,71.75 U$29.1 38.06,71.79 40.49,71.79 41.04,71.79 41.66,71.79 U1.EN
  Bottom 0.3: v45.61,52.97 40.27,52.97 39.56,53.69 39.56,65.39 41.06,66.89 41.06,67.24 | 41.06,67.24 41.06,68.97 | v41.09,69.01 41.09,67.27 41.06,67.24
RTS
  Top 0.305: U$28.5 47,52.36 46.35,51.71 U$28.1 46.35,45.44 46.66,45.13 49.76,45.13 50.09,44.79 U$2.RTS
RXD  (via drill 0.1 pad 0.4)
  Top 0.4: v65,70.52 U$17.1 | v50.07,39.99 50.07,38.67 U$2.RXD
  Bottom 0.4: v65,70.52 50.27,70.52 49.31,69.57 49.31,40.44 49.75,39.99 v50.07,39.99
SCL  (via drill 0.1 pad 0.3, 0.1 pad 0.5)
  Top 0.305: IC1.23 51.25,54.57 51.41,54.73 v51.41,54.94 | 61.25,71.79 U1.IO22 | v55.94,48.97 55.95,48.96 U$11.2
  Top 0.4: U$3.SCK v58.51,51.02 | v58.51,51.02
  Top 0.406: v66.04,65.92 69.64,62.32 69.64,59.35 70.65,58.34 J2.7
  Top 0.508: v63,72 62.79,71.79 61.25,71.79
  Bottom 0.305: 51.41,54.54 51.41,54.18 51.25,54.02 51.25,52.5 51.44,52.32 58.95,52.32 59.21,52.05 59.21,51.14 59.09,51.02 v58.51,51.02 58.51,51.03 56.13,51.03 55.94,50.84 v55.94,48.97 | v51.41,54.93 v51.41,54.94 | 65.71,68.86 65.66,68.82
  Bottom 0.406: v66.04,65.92 65.1,66.85 65.1,68.26 | 65.66,68.82 65.1,68.26 | 65.71,68.86 65.71,70.98 65.23,71.45 63.54,71.45 v63,72 | 65.1,68.26 64.08,68.26 63.61,67.79 63.61,56.65 62.71,55.75 51.85,55.75 51.41,55.31 v51.41,54.93 51.41,54.54
SDA  (via drill 0.1 pad 0.3, 0.1 pad 0.5)  (2 unrouted)
  Top 0.305: v50.74,54.94 v50.75,54.94 IC1.24 | 61.21,67.98 U1.IO21 | v54.9,48.96 U$12.2
  Top 0.4: U$3.SDI v58.52,51.67
  Top 0.508: 64.44,67.49 63.51,67.49 v63,68 62.98,67.98 61.21,67.98 | v64.86,65.7 68.85,61.71 68.85,58.18 69.67,57.36 69.67,56.54 70.4,55.81 J2.6
  Bottom 0.305: v58.52,51.67 55.17,51.67 | 55.17,51.67 55,51.67 | 55,51.67 54.54,51.67 | 54.54,51.67 52,51.67 | 62.44,56.36 62.66,56.57 | 63.02,67.97 v63,68 | v54.9,48.96 54.9,51.32 | 54.9,51.32 54.9,51.58 55,51.67 | 54.54,51.67 54.9,51.32 | 54.9,51.32 55.17,51.59 55.17,51.67
  Bottom 0.406: 62.66,56.57 63.02,56.93 63.02,56.94 | 63.02,67.97 63.02,56.94 62.44,56.36 51.15,56.36 50.74,55.96 v50.74,54.94 50.74,52.04 51.11,51.67 52,51.67 55,51.67 | v58.52,51.67 54.54,51.67
  Bottom 0.508: v64.48,67.5 64.48,66.05 64.78,65.75
TXD  (via drill 0.1 pad 0.4)
  Top 0.305: U$16.1 64.33,69.24
  Top 0.4: v65,69.25 U$16.1 | U$2.TXD 48.82,40.18 49.3,40.66 v50.05,40.66 v50.06,40.66
  Bottom 0.4: v50.06,40.66 50.06,46.92 50.06,68.41 50.91,69.25 v65,69.25
VCC  (via drill 0.1 pad 0.3, 0.1 pad 0.4, 0.1 pad 0.8, 0.1 pad 1, 0.2 pad 1)  (2 unrouted)
  Top 0.305: U$3.VDDIO 55.87,51.67 55.49,52.06 55.49,52.8 55.66,52.97 U$3.VDD | IC1.8 51.25,49.5 50.69,48.94 | IC1.13 53.97,50.53 53.97,50.35 53.84,50.23 53.84,49.46
  Top 0.4: U$3.VDDIO 55.54,51.67 | 54.78,50.91 54.61,50.75 54.54,50.75 | 54.78,50.91 55.09,51.22 | 55.09,51.22 55.54,51.67 | 55.54,51.67 55.49,51.72 55.49,52.06 | v61.32,52.51 U$4.2 | IC1.13 54.3,50.75 | 54.3,50.75 54.54,50.75 | 54.54,50.75 54.78,50.5 | 55.09,50.2 55.32,49.96 | v61.32,50.74 60.54,49.96 57.32,49.96 | 57.32,49.96 56.83,49.96 | 56.83,49.96 56.33,49.96 | 56.33,49.96 55.32,49.96 | 55.09,51.22 55.09,50.2 | 55.09,50.2 54.78,50.5 | 54.78,50.5 54.78,50.91 | 53.84,49.46 53.97,49.58 | 53.97,50.53 53.97,49.58 | 53.97,49.58 54.3,49.92 | 54.3,50.75 54.3,50.44 | 54.3,50.44 54.3,49.92 | 54.78,50.5 54.78,50.39 54.34,49.96 | 55.09,50.2 54.55,50.2 54.3,50.44 | 55.32,49.96 54.34,49.96 | 54.34,49.96 54.3,49.92 | U$11.1 56.62,47.02 56.83,47.23 56.83,49.46 | 56.83,49.96 56.83,49.74 56.83,49.46 | 56.83,49.46 56.33,49.96 | 56.83,49.46 57.32,49.95 57.32,49.96
  Top 0.5: v56.81,49.74 56.82,49.74 56.83,49.74
  Top 0.508: U$2.VCC 47.55,42.84 | 47.55,42.84 47.55,42.64 46.92,42.01 | 46.72,42.01 47.55,42.84 | 47.55,42.84 48.39,42.01 48.47,42.01 | U1.3.3V 37.7,73.06 36.9,73.86 U$30.2 | 42.39,54.04 47.87,54.04 48.6,53.3 48.6,49.04 49.61,48.03 U$6.1 | 42.39,54.04 41.66,54.04 | 41.66,54.54 41.89,54.54 42.39,54.04 | 41.66,52 41.66,53.31 42.39,54.04 | U$12.1 U$11.1 | U$9.1 v53.84,48.93 | v53.84,48.93 53.84,49.46 | U$6.1 50.69,48.94 | v50.72,48.93 50.72,48.07 U$6.1 | v53.84,48.94 v53.84,48.93
  Top 1: 41.65,38.97 U$18.2 IC3.VOUT 41.66,44.25 | U$14.2 62.31,41.25 IC2.VOUT 62.33,41.84 | 62.33,45.79 62.33,45.25 61.45,46.13 61.2,46.13 | 62.33,46.92 IC2.VOUT1 60.48,47.07 v60.03,47.52 | 62.33,45 61.2,46.13 | IC3.VOUT1 41.66,44.25 | 41.66,44.25 40.54,45.38 40.54,47.13 41.6,47.13 IC3.VOUT1 | 42.23,44.82 42.78,45.37 42.78,46.73 | 41.66,44.25 42.23,44.82 | 42.23,44.82 42.23,45.7 41.07,45.7 | 62.33,44.25 61.2,45.38 61.2,46.13 | U1.3.3V 44.15,73.06 44.77,72.45 44.77,57.1 43.97,56.3 42.37,56.3 41.66,55.59 41.66,54.54 41.66,54.04 41.66,52 IC3.VOUT1
  Top 1.016: 62.33,41.84 62.33,44.25 | 62.33,45.79 62.33,46.92 | 63.25,45.18 63.45,45.38 63.45,46.59 63.12,46.59 62.33,45.79 | 63.25,45.18 62.33,44.25 | 62.33,44.25 62.33,45.79 | IC2.VOUT1 63.25,46.14 63.25,45.18 | v39.79,51.88 39.79,50.73 37.24,48.19 J3.6
  Top 1.5: IC3.VOUT1 46.72,42.01 46.92,42.01 48.47,42.01 57.39,42.01 61.45,46.06 61.45,46.13
  Bottom 0.4: v61.32,50.75 v61.32,50.74
  Bottom 0.508: v50.72,48.93 v50.73,48.94 v53.84,48.94 | v61.32,52.51 v61.32,50.75
  Bottom 1: v56.81,49.74 58.68,49.74 59.1,49.32 v59.1,47.52 v59.11,47.52 v60.03,47.52
  Bottom 1.016: v41.65,50.38 41.29,50.38 39.78,51.89
(copper drawn outside any net)
  shapes: Top area x2

### Text on the board
tPlace: GND | IO25 | IO26 | SCL | IO14 | SDA | IO12 | IO19 | B+ | IO18 | VCC | IO5 | IO17 | GND | IO16
bPlace: + | - | - | + | BATTERY | 3.7V | - | - | + | - | + | - | +